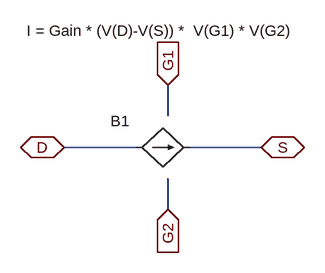
[diagram p0: schematic ampar.asc]
ampar.asc, the LTspice schematic file:
Version 4
SHEET 1 880 680
WIRE 176 64 176 16
WIRE 128 112 16 112
WIRE 320 112 208 112
WIRE 176 208 176 160
FLAG 16 112 D
IOPIN 16 112 BiDir
FLAG 176 208 G2
IOPIN 176 208 In
FLAG 320 112 S
IOPIN 320 112 BiDir
FLAG 176 16 G1
IOPIN 176 16 In
SYMBOL bi2 208 112 R90
WINDOW 0 -25 106 VBottom 2
WINDOW 3 -195 44 VTop 2
SYMATTR InstName B1
SYMATTR Value I = Gain * (V(D)-V(S)) *  V(G1) * V(G2)

The netlist it stands for:
* ampar.asc
B1 D S I = Gain * (V(D)-V(S)) *  V(G1) * V(G2)
.backanno
.end